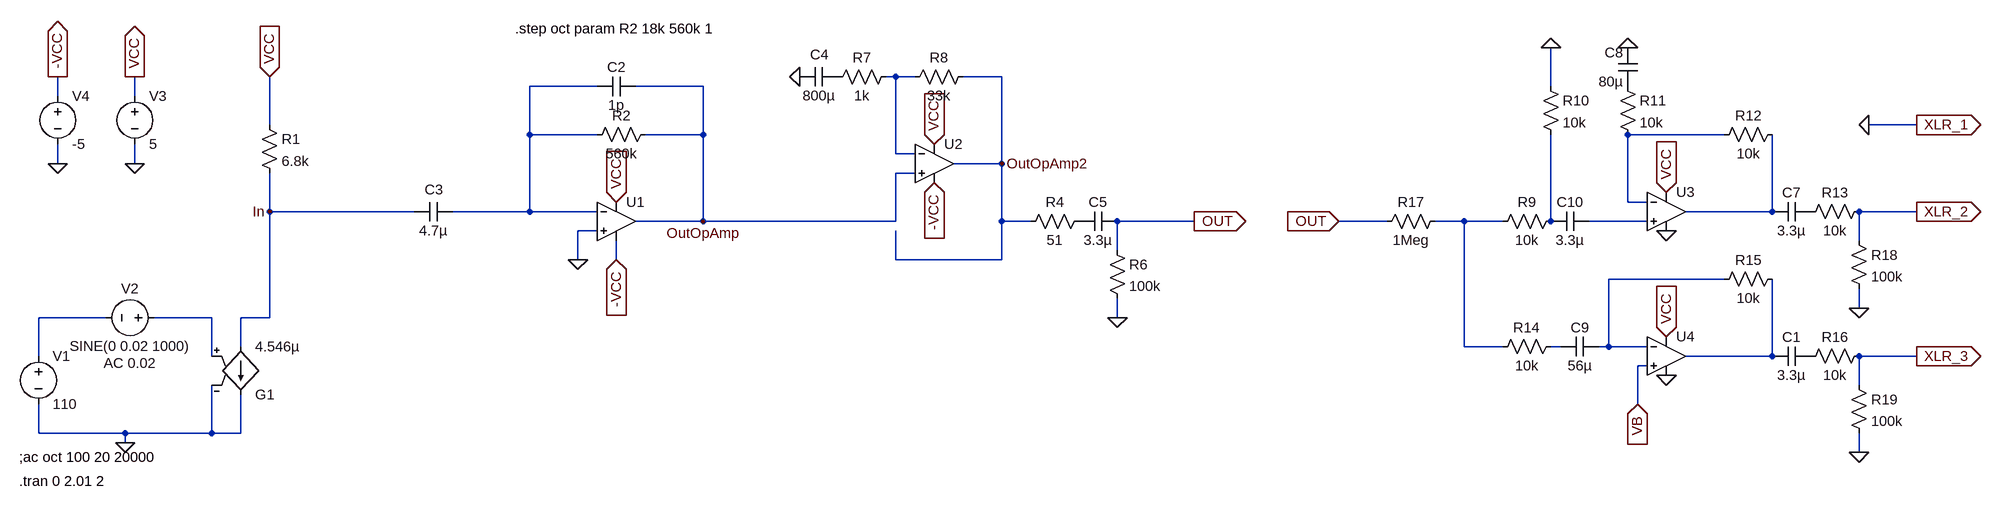
[diagram p0: schematic CicuitoLD-MC-6035W - 5 Dual Supply.asc]
CicuitoLD-MC-6035W - 5 Dual Supply.asc, the LTspice schematic file:
Version 4
SHEET 1 3400 1260
WIRE 1504 -352 1488 -352
WIRE 1536 -352 1504 -352
WIRE 1680 -352 1616 -352
WIRE 1008 -336 896 -336
WIRE 1184 -336 1072 -336
WIRE 2592 -336 2592 -400
WIRE 112 -320 112 -352
WIRE 240 -320 240 -352
WIRE 464 -272 464 -352
WIRE 3200 -272 3120 -272
WIRE 896 -256 896 -336
WIRE 1008 -256 896 -256
WIRE 1184 -256 1184 -336
WIRE 1184 -256 1088 -256
WIRE 2880 -256 2720 -256
WIRE 1504 -224 1504 -352
WIRE 1536 -224 1504 -224
WIRE 112 -208 112 -240
WIRE 240 -208 240 -240
WIRE 1680 -208 1680 -352
WIRE 1680 -208 1600 -208
WIRE 1536 -192 1504 -192
WIRE 2720 -144 2720 -256
WIRE 2752 -144 2720 -144
WIRE 464 -128 464 -192
WIRE 704 -128 464 -128
WIRE 896 -128 896 -256
WIRE 896 -128 768 -128
WIRE 1008 -128 896 -128
WIRE 2960 -128 2960 -256
WIRE 2960 -128 2816 -128
WIRE 3200 -128 3104 -128
WIRE 1184 -112 1184 -256
WIRE 1184 -112 1072 -112
WIRE 1504 -112 1504 -192
WIRE 1504 -112 1184 -112
WIRE 1680 -112 1680 -208
WIRE 1728 -112 1680 -112
WIRE 2000 -112 1872 -112
WIRE 2320 -112 2240 -112
WIRE 2448 -112 2400 -112
WIRE 2512 -112 2448 -112
WIRE 2592 -112 2592 -256
WIRE 2752 -112 2656 -112
WIRE 1008 -96 976 -96
WIRE 3104 -80 3104 -128
WIRE 1872 -64 1872 -112
WIRE 976 -48 976 -96
WIRE 1040 -48 1040 -80
WIRE 1504 -48 1504 -96
WIRE 1680 -48 1680 -112
WIRE 1680 -48 1504 -48
WIRE 2880 -16 2688 -16
WIRE 3104 32 3104 0
WIRE 192 48 80 48
WIRE 368 48 272 48
WIRE 464 48 464 -128
WIRE 464 48 416 48
WIRE 1872 48 1872 16
WIRE 416 96 416 48
WIRE 2448 96 2448 -112
WIRE 2512 96 2448 96
WIRE 2608 96 2592 96
WIRE 2688 96 2688 -16
WIRE 2688 96 2672 96
WIRE 2752 96 2688 96
WIRE 80 112 80 48
WIRE 368 112 368 48
WIRE 2960 112 2960 -16
WIRE 2960 112 2816 112
WIRE 3200 112 3104 112
WIRE 2752 128 2736 128
WIRE 3104 160 3104 112
WIRE 2736 192 2736 128
WIRE 80 240 80 192
WIRE 224 240 80 240
WIRE 368 240 368 160
WIRE 368 240 224 240
WIRE 416 240 416 176
WIRE 416 240 368 240
WIRE 224 256 224 240
WIRE 3104 272 3104 240
FLAG 224 256 0
FLAG 240 -352 VCC
IOPIN 240 -352 Out
FLAG 240 -208 0
FLAG 464 -352 VCC
IOPIN 464 -352 In
FLAG 1040 -144 VCC
IOPIN 1040 -144 In
FLAG 1872 48 0
FLAG 2000 -112 OUT
IOPIN 2000 -112 Out
FLAG 1184 -112 OutOpAmp
FLAG 464 -128 In
FLAG 1568 -240 VCC
IOPIN 1568 -240 In
FLAG 1344 -352 0
FLAG 1680 -208 OutOpAmp2
FLAG 2592 -400 0
FLAG 2784 -160 VCC
IOPIN 2784 -160 In
FLAG 2784 80 VCC
IOPIN 2784 80 In
FLAG 2784 -96 0
FLAG 2784 144 0
FLAG 2736 192 VB
IOPIN 2736 192 In
FLAG 3200 -128 XLR_2
IOPIN 3200 -128 Out
FLAG 3200 112 XLR_3
IOPIN 3200 112 Out
FLAG 3200 -272 XLR_1
IOPIN 3200 -272 Out
FLAG 3120 -272 0
FLAG 2720 -400 0
FLAG 2240 -112 OUT
IOPIN 2240 -112 In
FLAG 3104 32 0
FLAG 3104 272 0
FLAG 112 -352 -VCC
IOPIN 112 -352 Out
FLAG 112 -208 0
FLAG 1040 -48 -VCC
IOPIN 1040 -48 In
FLAG 1568 -176 -VCC
IOPIN 1568 -176 In
FLAG 976 -48 0
SYMBOL voltage 80 96 R0
WINDOW 123 24 124 Left 2
WINDOW 39 0 0 Left 0
SYMATTR InstName V1
SYMATTR Value 110
SYMBOL voltage 288 48 R90
WINDOW 0 -32 56 VBottom 2
WINDOW 3 32 56 VTop 2
WINDOW 123 60 56 VTop 2
WINDOW 39 0 0 Left 0
SYMATTR InstName V2
SYMATTR Value SINE(0 0.02 1000)
SYMATTR Value2 AC 0.02
SYMBOL g2 416 192 M180
SYMATTR InstName G1
SYMATTR Value 4.546µ
SYMBOL voltage 240 -336 R0
WINDOW 123 0 0 Left 0
WINDOW 39 0 0 Left 0
SYMATTR InstName V3
SYMATTR Value 5
SYMBOL res 448 -288 R0
SYMATTR InstName R1
SYMATTR Value 6.8k
SYMBOL cap 768 -144 R90
WINDOW 0 -5 31 VBottom 2
WINDOW 3 32 32 VTop 2
SYMATTR InstName C3
SYMATTR Value 4.7µ
SYMBOL res 1104 -272 R90
WINDOW 0 0 56 VBottom 2
WINDOW 3 32 56 VTop 2
SYMATTR InstName R2
SYMATTR Value 560k
SYMBOL cap 1072 -352 R90
WINDOW 0 0 32 VBottom 2
WINDOW 3 32 32 VTop 2
SYMATTR InstName C2
SYMATTR Value 1p
SYMBOL res 1824 -128 R90
WINDOW 0 0 56 VBottom 2
WINDOW 3 32 56 VTop 2
SYMATTR InstName R4
SYMATTR Value 51
SYMBOL cap 1872 -128 R90
WINDOW 0 0 32 VBottom 2
WINDOW 3 32 32 VTop 2
SYMATTR InstName C5
SYMATTR Value 3.3µ
SYMBOL res 1856 -80 R0
SYMATTR InstName R6
SYMATTR Value 100k
SYMBOL OpAmps\\UniversalOpamp2 1040 -112 R0
SYMATTR InstName U1
SYMBOL res 1392 -336 R270
WINDOW 0 32 56 VTop 2
WINDOW 3 0 56 VBottom 2
SYMATTR InstName R7
SYMATTR Value 1k
SYMBOL res 1632 -368 R90
WINDOW 0 0 56 VBottom 2
WINDOW 3 32 56 VTop 2
SYMATTR InstName R8
SYMATTR Value 33k
SYMBOL OpAmps\\UniversalOpamp2 1568 -208 R0
SYMATTR InstName U2
SYMBOL cap 1408 -368 R90
WINDOW 0 -5 31 VBottom 2
WINDOW 3 32 32 VTop 2
SYMATTR InstName C4
SYMATTR Value 800µ
SYMBOL OpAmps\\UniversalOpamp2 2784 -128 R0
SYMATTR InstName U3
SYMBOL OpAmps\\UniversalOpamp2 2784 112 R0
SYMATTR InstName U4
SYMBOL res 2608 -128 R90
WINDOW 0 0 56 VBottom 2
WINDOW 3 32 56 VTop 2
SYMATTR InstName R9
SYMATTR Value 10k
SYMBOL res 2576 -352 R0
SYMATTR InstName R10
SYMATTR Value 10k
SYMBOL res 2704 -352 R0
SYMATTR InstName R11
SYMATTR Value 10k
SYMBOL res 2976 -272 R90
WINDOW 0 0 56 VBottom 2
WINDOW 3 32 56 VTop 2
SYMATTR InstName R12
SYMATTR Value 10k
SYMBOL res 3120 -144 R90
WINDOW 0 0 56 VBottom 2
WINDOW 3 32 56 VTop 2
SYMATTR InstName R13
SYMATTR Value 10k
SYMBOL res 2608 80 R90
WINDOW 0 0 56 VBottom 2
WINDOW 3 32 56 VTop 2
SYMATTR InstName R14
SYMATTR Value 10k
SYMBOL res 2976 -32 R90
WINDOW 0 0 56 VBottom 2
WINDOW 3 32 56 VTop 2
SYMATTR InstName R15
SYMATTR Value 10k
SYMBOL res 3120 96 R90
WINDOW 0 0 56 VBottom 2
WINDOW 3 32 56 VTop 2
SYMATTR InstName R16
SYMATTR Value 10k
SYMBOL cap 3024 96 R90
WINDOW 0 0 32 VBottom 2
WINDOW 3 32 32 VTop 2
SYMATTR InstName C1
SYMATTR Value 3.3µ
SYMBOL cap 3024 -144 R90
WINDOW 0 0 32 VBottom 2
WINDOW 3 32 32 VTop 2
SYMATTR InstName C7
SYMATTR Value 3.3µ
SYMBOL cap 2736 -336 R180
WINDOW 0 24 56 Left 2
WINDOW 3 24 8 Left 2
SYMATTR InstName C8
SYMATTR Value 80µ
SYMBOL cap 2672 80 R90
WINDOW 0 0 32 VBottom 2
WINDOW 3 32 32 VTop 2
SYMATTR InstName C9
SYMATTR Value 56µ
SYMBOL cap 2656 -128 R90
WINDOW 0 0 32 VBottom 2
WINDOW 3 32 32 VTop 2
SYMATTR InstName C10
SYMATTR Value 3.3µ
SYMBOL res 2304 -96 R270
WINDOW 0 32 56 VTop 2
WINDOW 3 0 56 VBottom 2
SYMATTR InstName R17
SYMATTR Value 1Meg
SYMBOL res 3088 -96 R0
SYMATTR InstName R18
SYMATTR Value 100k
SYMBOL res 3088 144 R0
SYMATTR InstName R19
SYMATTR Value 100k
SYMBOL voltage 112 -336 R0
WINDOW 123 0 0 Left 0
WINDOW 39 0 0 Left 0
SYMATTR InstName V4
SYMATTR Value -5
TEXT 872 -432 Left 2 !.step oct param R2 18k 560k 1
TEXT 48 280 Left 2 !;ac oct 100 20 20000
TEXT 48 320 Left 2 !.tran 0 2.01 2

The netlist it stands for:
* CicuitoLD-MC-6035W - 5 Dual Supply.asc
V1 N009 0 110
V2 N010 N009 SINE(0 0.02 1000) AC 0.02
G1 In 0 N010 0 4.546µ
V3 VCC 0 5
R1 VCC In 6.8k
C3 N002 In 4.7µ
R2 OutOpAmp N002 560k
C2 OutOpAmp N002 1p
R4 P001 OutOpAmp2 51
C5 OUT P001 3.3µ
R6 OUT 0 100k
XU1 0 N002 VCC -VCC OutOpAmp level.2 Avol=1Meg GBW=10Meg Slew=10Meg ilimit=25m rail=0 Vos=0 phimargin=45 en=0 enk=0 in=0 ink=0 Rin=500Meg  ; pins IN+ IN- V+ V- OUT
R7 P002 N001 1k
R8 OutOpAmp2 N001 33k
XU2 OutOpAmp N001 VCC -VCC OutOpAmp2 level.2 Avol=1Meg GBW=10Meg Slew=10Meg ilimit=25m rail=0 Vos=0 phimargin=45 en=0 enk=0 in=0 ink=0 Rin=500Meg  ; pins IN+ IN- V+ V- OUT
C4 P002 0 800µ
XU3 N007 N003 VCC 0 N004 level.2 Avol=1Meg GBW=10Meg Slew=10Meg ilimit=25m rail=0 Vos=0 phimargin=45 en=0 enk=0 in=0 ink=0 Rin=500Meg  ; pins IN+ IN- V+ V- OUT
XU4 VB N008 VCC 0 N012 level.2 Avol=1Meg GBW=10Meg Slew=10Meg ilimit=25m rail=0 Vos=0 phimargin=45 en=0 enk=0 in=0 ink=0 Rin=500Meg  ; pins IN+ IN- V+ V- OUT
R9 N006 N005 10k
R10 0 N006 10k
R11 P003 N003 10k
R12 N004 N003 10k
R13 XLR_2 P004 10k
R14 N011 N005 10k
R15 N012 N008 10k
R16 XLR_3 P005 10k
C1 P005 N012 3.3µ
C7 P004 N004 3.3µ
C8 P003 0 80µ
C9 N008 N011 56µ
C10 N007 N006 3.3µ
R17 OUT N005 1Meg
R18 XLR_2 0 100k
R19 XLR_3 0 100k
V4 -VCC 0 -5
.step oct param R2 18k 560k 1
;ac oct 100 20 20000
.tran 0 2.01 2
.lib UniversalOpamps2.sub
.backanno
.end